# EAGLE schematic docs (EAGLE 4.13)
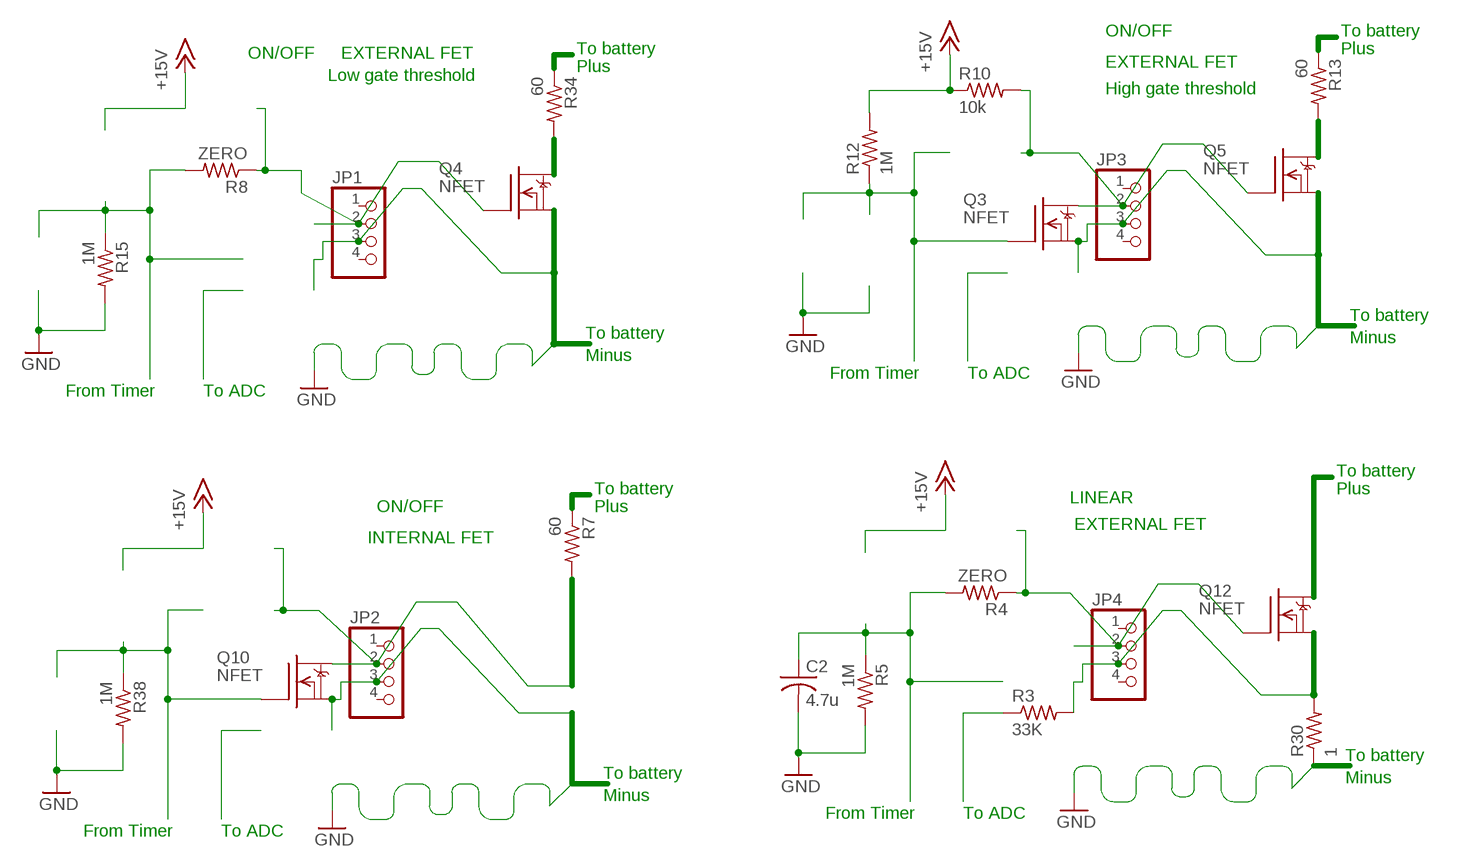
[diagram p0: schematic, sheet 1]

## Parts
C2  4.7u  C-USC0603  [C0603]
JP1  PINHD-1X4  [1X04]
JP2  PINHD-1X4  [1X04]
JP3  PINHD-1X4  [1X04]
JP4  PINHD-1X4  [1X04]
Q3  NFET  DMN3404L  [SOT-23]
Q4  NFET  DMN3404L  [SOT-23]
Q5  NFET  DMN3404L  [SOT-23]
Q10  NFET  DMN3404L  [SOT-23]
Q12  NFET  DMN3404L  [SOT-23]
R3  33K  R-US_R0603  [R0603]
R4  ZERO  R-US_R0603  [R0603]
R5  1M  R-US_R0603  [R0603]
R7  60  R-US_R0603  [R0603]
R8  ZERO  R-US_R0603  [R0603]
R10  10k  R-US_R0603  [R0603]
R12  1M  R-US_R0603  [R0603]
R13  60  R-US_R0603  [R0603]
R15  1M  R-US_R0603  [R0603]
R30  1  R-US_R0603  [R0603]
R34  60  R-US_R0603  [R0603]
R38  1M  R-US_R0603  [R0603]

## Nets
+15V: R10.1 R12.2
DUMPFETSOURCE: JP2.3 Q10.2(S)
DUMPFETSOURCE4: JP4.3 Q12.2(S) R3.2 R30.2
DUMPFETSOURCE6: JP3.3 Q3.2(S) Q5.2(S)
GND: C2.2 JP1.3 Q4.2(S) R5.2 R15.2 R38.2
JP12-FETDRAIN-RC: JP2.2 Q10.3(D) R7.2
JP12-FETDRAIN-RC2: JP4.2 Q12.1(G) R4.1
JP12-FETDRAIN-RC3: JP1.2 Q4.1(G) R8.1
JP12-FETDRAIN-RC4: JP3.2 Q3.3(D) Q5.1(G) R10.2
N$1: Q4.3(D) R34.2
N$2: Q12.3(D)
N$3: R30.1
N$4: R7.1
N$6: Q5.3(D) R13.2
N$7: R34.1
N$9: R13.1
PA1-DUMPFETGATE: Q10.1(G) R38.1
PA1-DUMPFETGATE2: C2.1 R4.2 R5.1
PA1-DUMPFETGATE3: R8.2 R15.1
PA1-DUMPFETGATE4: Q3.1(G) R12.1
PA3-DUMP-CURRENT2: R3.1
Unconnected: JP1.1 JP1.4 JP2.1 JP2.4 JP3.1 JP3.4 JP4.1 JP4.4

## Notes on the sheet
- ON/OFF | To battery
- ON/OFF | EXTERNAL FET | To battery | Plus
- Plus | EXTERNAL FET
- Low gate threshold
- High gate threshold
- To battery
- To battery | Minus
- Minus
- From Timer | To ADC
- From Timer | To ADC
- To battery
- To battery | Plus
- LINEAR
- ON/OFF | Plus
- EXTERNAL FET
- INTERNAL FET
- To battery
- To battery | Minus
- Minus
- From Timer | To ADC
- From Timer | To ADC

## Library data of the parts
C2 = rcl:C-US: CAPACITOR, American symbol
JP1-JP4 = pinhead:PINHD-1X4: PIN HEADER
Q3-Q5 Q10 Q12 = transistor-fet:DMN3404L
R3-R5 R7 R8 R10 R12 R13 R15 R30 R34 R38 = rcl:R-US_: RESISTOR, American symbol